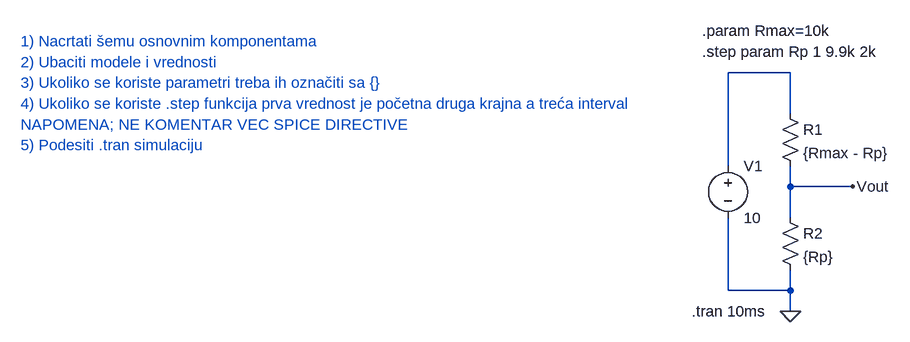
[diagram p0: schematic V5_POT.asc]
V5_POT.asc, the LTspice schematic file:
Version 4
SHEET 1 880 680
WIRE 16 112 -80 112
WIRE 16 176 16 112
WIRE -80 256 -80 112
WIRE 16 288 16 256
WIRE 112 288 16 288
WIRE 16 336 16 288
WIRE -80 448 -80 336
WIRE 16 448 16 416
WIRE 16 448 -80 448
WIRE 16 480 16 448
FLAG 16 480 0
FLAG 112 288 Vout
SYMBOL voltage -80 240 R0
WINDOW 123 0 0 Left 0
WINDOW 39 0 0 Left 0
SYMATTR InstName V1
SYMATTR Value 10
SYMBOL res 0 160 R0
SYMATTR InstName R1
SYMATTR Value {Rmax - Rp}
SYMBOL res 0 320 R0
SYMATTR InstName R2
SYMATTR Value {Rp}
TEXT -1168 64 Left 2 ;1) Nacrtati šemu osnovnim komponentama
TEXT -1168 96 Left 2 ;2) Ubaciti modele i vrednosti
TEXT -1168 224 Left 2 ;5) Podesiti .tran simulaciju
TEXT -120 48 Left 2 !.param Rmax=10k
TEXT -120 80 Left 2 !.step param Rp 1 9.9k 2k
TEXT -136 480 Left 2 !.tran 10ms
TEXT -1168 128 Left 2 ;3) Ukoliko se koriste parametri treba ih označiti sa {}
TEXT -1168 160 Left 2 ;4) Ukoliko se koriste .step funkcija prva vrednost je početna druga krajna a treća interval
TEXT -1168 192 Left 2 ;NAPOMENA; NE KOMENTAR VEC SPICE DIRECTIVE

The netlist it stands for:
* V5_POT.asc
V1 N001 0 10
R1 N001 Vout {Rmax - Rp}
R2 Vout 0 {Rp}
* 1) Nacrtati šemu osnovnim komponentama
* 2) Ubaciti modele i vrednosti
* 5) Podesiti .tran simulaciju
.param Rmax=10k
.step param Rp 1 9.9k 2k
.tran 10ms
* 3) Ukoliko se koriste parametri treba ih označiti sa {}
* 4) Ukoliko se koriste .step funkcija prva vrednost je početna druga krajna a treća interval
* NAPOMENA; NE KOMENTAR VEC SPICE DIRECTIVE
.backanno
.end